# Altium schematic sheet StepDirDriver.SchDoc
size A4
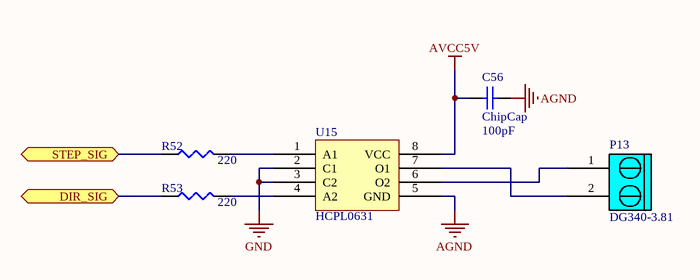
[diagram p0: StepDirDriver.SchDoc]

## Parts
C56  ChipCap  value 100pF  [CAP0805]
P13  DG340-3.81  [DG340-3.81-02P-00A(H)]
R52  value 220  [RES0805]  (hidden comment: ChipRes)
R53  value 220  [RES0805]  (hidden comment: ChipRes)
U15  HCPL0631  [SOIC8]

## Ports
DIR_SIG, STEP_SIG

## Nets
AGND: C56.2 U15.5(GND)
AVCC5V: C56.1 U15.8(VCC)
GND: U15.2(C1) U15.3(C2)
DIR_SIG: R53.1 ; port DIR_SIG
STEP_SIG: R52.1 ; port STEP_SIG
NetP13_1: P13.1 U15.6(O2)
NetP13_2: P13.2 U15.7(O1)
NetR52_2: R52.2 U15.1(A1)
NetR53_2: R53.2 U15.4(A2)

## Library data of the parts
C56 = ChipCap: Capacitor; Published: 8-Jun-2000; LatestRevisionDate: 17-Jul-2002; LatestRevisionNote: Re-released for DXP Platform.; PackageReference: RAD-0.3; Publisher: Altium Limited
P13 = DG340-3.81-02P: Terminal block
R52 R53 = ChipRes: Chip resistor
U15 = HCPL0631: 2-channel opto-coupler